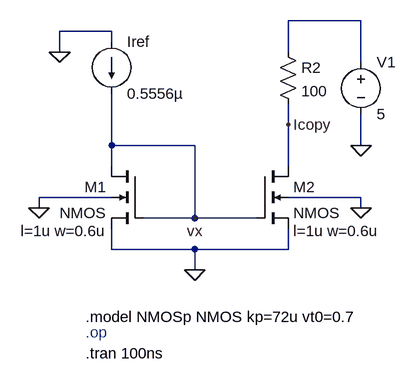
[diagram p0: schematic Currentmirrorschematic.asc]
Currentmirrorschematic.asc, the LTspice schematic file:
Version 4.1
SHEET 1 880 680
WIRE 480 -80 368 -80
WIRE 96 -64 16 -64
WIRE 96 -48 96 -64
WIRE 16 -32 16 -64
WIRE 368 -32 368 -80
WIRE 480 -16 480 -80
WIRE 368 80 368 48
WIRE 96 112 96 32
WIRE 224 112 96 112
WIRE 480 112 480 64
WIRE 96 144 96 112
WIRE 368 144 368 80
WIRE 96 192 -16 192
WIRE 480 192 368 192
WIRE -16 208 -16 192
WIRE 480 208 480 192
WIRE 224 224 224 112
WIRE 224 224 144 224
WIRE 320 224 224 224
WIRE 96 272 96 240
WIRE 224 272 96 272
WIRE 368 272 368 240
WIRE 368 272 224 272
WIRE 224 304 224 272
FLAG 224 224 vx
FLAG 368 80 Icopy
FLAG -16 208 0
FLAG 480 208 0
FLAG 16 -32 0
FLAG 480 112 0
FLAG 224 304 0
SYMBOL current 96 -48 R0
WINDOW 123 0 0 Left 0
WINDOW 39 0 0 Left 0
SYMATTR InstName Iref
SYMATTR Value 0.5556µ
SYMBOL nmos4 144 144 M0
WINDOW 123 56 100 Left 2
SYMATTR Value2 l=1u w=0.6u
SYMATTR InstName M1
SYMBOL nmos4 320 144 R0
WINDOW 123 56 100 Left 2
SYMATTR Value2 l=1u w=0.6u
SYMATTR InstName M2
SYMBOL voltage 480 -32 R0
WINDOW 123 0 0 Left 0
WINDOW 39 0 0 Left 0
SYMATTR InstName V1
SYMATTR Value 5
SYMBOL res 352 -48 R0
SYMATTR InstName R2
SYMATTR Value 100
TEXT 56 376 Left 2 !.model NMOSp NMOS kp=72u vt0=0.7
TEXT 56 400 Left 2 ;.op
TEXT 56 432 Left 2 !.tran 100ns

The netlist it stands for:
* Currentmirrorschematic.asc
Iref 0 vx 0.5556µ
M1 vx vx 0 0 NMOS l=1u w=0.6u
M2 Icopy vx 0 0 NMOS l=1u w=0.6u
V1 N001 0 5
R2 N001 Icopy 100
.model NMOS NMOS
.model PMOS PMOS
.lib standard.mos
.model NMOSp NMOS kp=72u vt0=0.7
* .op
.tran 100ns
.backanno
.end